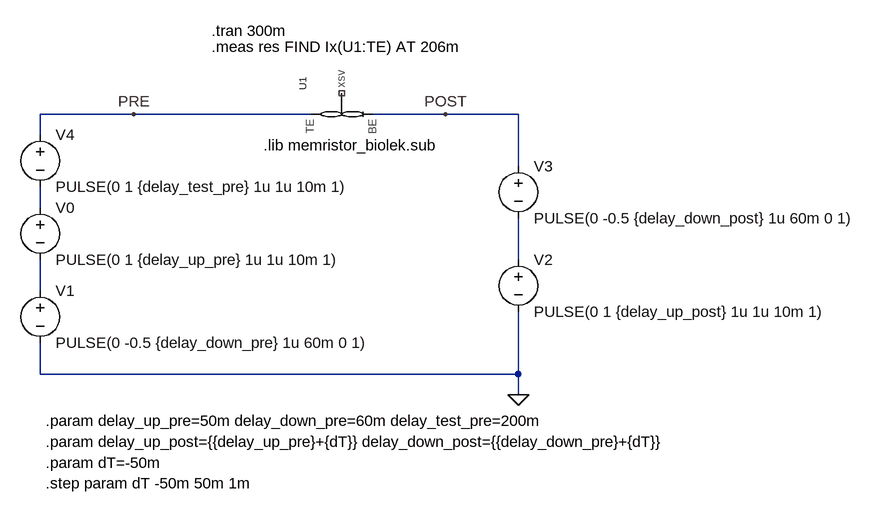
[diagram p0: schematic exp-1_1.asc]
exp-1_1.asc, the LTspice schematic file:
Version 4
SHEET 1 3028 680
WIRE 224 -16 80 -16
WIRE 496 -16 224 -16
WIRE 704 -16 592 -16
WIRE 816 -16 704 -16
WIRE 80 16 80 -16
WIRE 816 64 816 -16
WIRE 80 128 80 96
WIRE 816 208 816 144
WIRE 80 256 80 208
WIRE 80 384 80 336
WIRE 816 384 816 288
WIRE 816 384 80 384
WIRE 816 416 816 384
FLAG 224 -16 PRE
FLAG 816 416 0
FLAG 704 -16 POST
SYMBOL voltage 80 112 R0
WINDOW 123 0 0 Left 0
WINDOW 39 0 0 Left 0
SYMATTR InstName V0
SYMATTR Value PULSE(0 1 {delay_up_pre} 1u 1u 10m 1)
SYMBOL voltage 80 240 R0
WINDOW 123 0 0 Left 0
WINDOW 39 0 0 Left 0
SYMATTR InstName V1
SYMATTR Value PULSE(0 -0.5 {delay_down_pre} 1u 60m 0 1)
SYMBOL voltage 80 0 R0
WINDOW 123 0 0 Left 0
WINDOW 39 0 0 Left 0
SYMATTR InstName V4
SYMATTR Value PULSE(0 1 {delay_test_pre} 1u 1u 10m 1)
SYMBOL voltage 816 48 R0
WINDOW 123 0 0 Left 0
WINDOW 39 0 0 Left 0
SYMATTR InstName V3
SYMATTR Value PULSE(0 -0.5 {delay_down_post} 1u 60m 0 1)
SYMBOL voltage 816 192 R0
WINDOW 123 0 0 Left 0
WINDOW 39 0 0 Left 0
SYMATTR InstName V2
SYMATTR Value PULSE(0 1 {delay_up_post} 1u 1u 10m 1)
SYMBOL memristor_with_state 544 -16 R270
SYMATTR InstName U1
SYMATTR Value MEM_BIOLEK_WILLIAN
TEXT 344 -144 Left 2 !.tran 300m
TEXT 88 456 Left 2 !.param delay_up_pre=50m delay_down_pre=60m delay_test_pre=200m
TEXT 88 488 Left 2 !.param delay_up_post={{delay_up_pre}+{dT}} delay_down_post={{delay_down_pre}+{dT}}
TEXT 88 520 Left 2 !.param dT=-50m
TEXT 88 552 Left 2 !.step param dT -50m 50m 1m
TEXT 344 -120 Left 2 !.meas res FIND Ix(U1:TE) AT 206m
TEXT 424 32 Left 2 !.lib memristor_biolek.sub

The netlist it stands for:
* exp-1_1.asc
V0 N001 N003 PULSE(0 1 {delay_up_pre} 1u 1u 10m 1)
V1 N003 0 PULSE(0 -0.5 {delay_down_pre} 1u 60m 0 1)
V4 PRE N001 PULSE(0 1 {delay_test_pre} 1u 1u 10m 1)
V3 POST N002 PULSE(0 -0.5 {delay_down_post} 1u 60m 0 1)
V2 N002 0 PULSE(0 1 {delay_up_post} 1u 1u 10m 1)
XU1 PRE POST NC_01 MEM_BIOLEK_WILLIAN  ; pins TE BE xsv
.tran 300m
.param delay_up_pre=50m delay_down_pre=60m delay_test_pre=200m
.param delay_up_post={{delay_up_pre}+{dT}} delay_down_post={{delay_down_pre}+{dT}}
.param dT=-50m
.step param dT -50m 50m 1m
.meas res FIND Ix(U1:TE) AT 206m
.lib memristor_biolek.sub
.backanno
.end

* Results of the author's LTspice run, read from the files saved beside the schematic
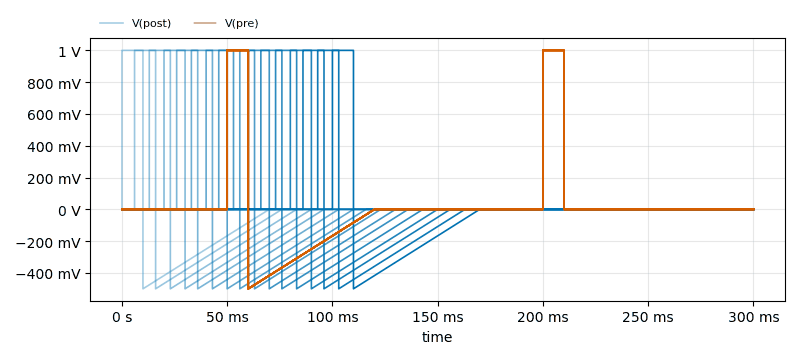
[diagram p1: Transient Analysis of exp-1_1.asc, plotted from the saved traces]
* Transient Analysis, 101 runs:
*   V(post) [run 1]: min -500 mV, max 1 V, average -16.66 mV, rms 225 mV, last 0 V
*   V(post) [run 2]: min -500 mV, max 1 V, average -16.66 mV, rms 224.9 mV, last 0 V
*   V(post) [run 3]: min -500 mV, max 1 V, average -16.66 mV, rms 224.9 mV, last 0 V
*   V(post) [run 4]: min -500 mV, max 1 V, average -16.66 mV, rms 226.5 mV, last 0 V
*   V(post) [run 5]: min -500 mV, max 1 V, average -16.66 mV, rms 227.8 mV, last 0 V
*   V(post) [run 6]: min -500 mV, max 1 V, average -16.66 mV, rms 230.4 mV, last 0 V
*   V(post) [run 7]: min -500 mV, max 1 V, average -16.66 mV, rms 234.2 mV, last 0 V
*   V(post) [run 8]: min -500 mV, max 1 V, average -16.66 mV, rms 238.3 mV, last 0 V
*   V(pre) [run 1]: min -500 mV, max 1 V, average 16.67 mV, rms 289.6 mV, last 0 V
*   V(pre) [run 2]: min -500 mV, max 1 V, average 16.67 mV, rms 289.6 mV, last 0 V
*   V(pre) [run 3]: min -500 mV, max 1 V, average 16.67 mV, rms 289.6 mV, last 0 V
*   V(pre) [run 4]: min -500 mV, max 1 V, average 16.67 mV, rms 290.9 mV, last 0 V
*   V(pre) [run 5]: min -500 mV, max 1 V, average 16.67 mV, rms 292.1 mV, last 0 V
*   V(pre) [run 6]: min -500 mV, max 1 V, average 16.67 mV, rms 294.2 mV, last 0 V
*   V(pre) [run 7]: min -500 mV, max 1 V, average 16.67 mV, rms 296.9 mV, last 0 V
*   V(pre) [run 8]: min -500 mV, max 1 V, average 16.67 mV, rms 300.2 mV, last 0 V
* From the log:
*   Measurement: res
*     step  ix(u1:te)  at
*        1  1.01083e-005  0.206
*        2  1.01084e-005  0.206
*        3  1.01084e-005  0.206
*        4  1.01084e-005  0.206
*        5  1.01084e-005  0.206
*        6  1.01084e-005  0.206
*        7  1.01082e-005  0.206
*        8  1.01085e-005  0.206
*        9  1.01086e-005  0.206
*       10  1.01086e-005  0.206
*       11  1.01087e-005  0.206
*       12  1.01087e-005  0.206
*       13  1.01087e-005  0.206
*       14  1.01088e-005  0.206
*       15  1.01089e-005  0.206
*       16  1.01089e-005  0.206
*       17  1.0109e-005  0.206
*       18  1.01089e-005  0.206
*       19  1.01091e-005  0.206
*       20  1.01091e-005  0.206
*       21  1.01092e-005  0.206
*       22  1.01092e-005  0.206
*       23  1.01093e-005  0.206
*       24  1.01093e-005  0.206
*       25  1.01094e-005  0.206
*       26  1.01095e-005  0.206
*       27  1.01095e-005  0.206
*       28  1.01096e-005  0.206
*       29  1.01096e-005  0.206
*       30  1.01097e-005  0.206
*       31  1.01097e-005  0.206
*       32  1.01098e-005  0.206
*       33  1.01099e-005  0.206
*       34  1.01099e-005  0.206
*       35  1.011e-005  0.206
*       36  1.011e-005  0.206
*       37  1.01101e-005  0.206
*       38  1.01101e-005  0.206
*       39  1.01101e-005  0.206
*       40  1.01102e-005  0.206
*     ...